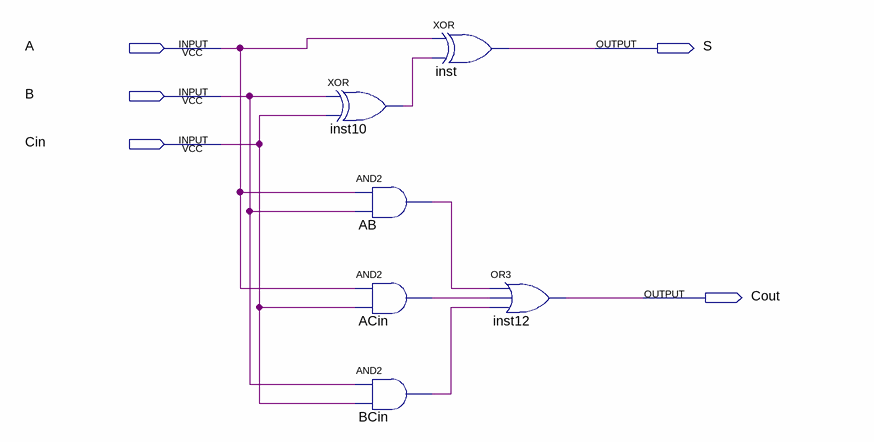
[diagram p0: schematic sheet]
// Quartus schematic fullAdder.bdf as structural Verilog: 6 symbols, 5 pins
module fullAdder (
  input  A,
  input  B,
  input  Cin,
  output S,
  output Cout
);

  wire AB_out, ACin_out, BCin_out, inst10_out;

  xor inst10 (inst10_out, B, Cin);
  and AB (AB_out, A, B);
  and ACin (ACin_out, A, Cin);
  and BCin (BCin_out, B, Cin);
  xor inst (S, A, inst10_out);
  or inst12 (Cout, AB_out, ACin_out, BCin_out);
endmodule
